# Altium project Dimmer_010.PrjPcb
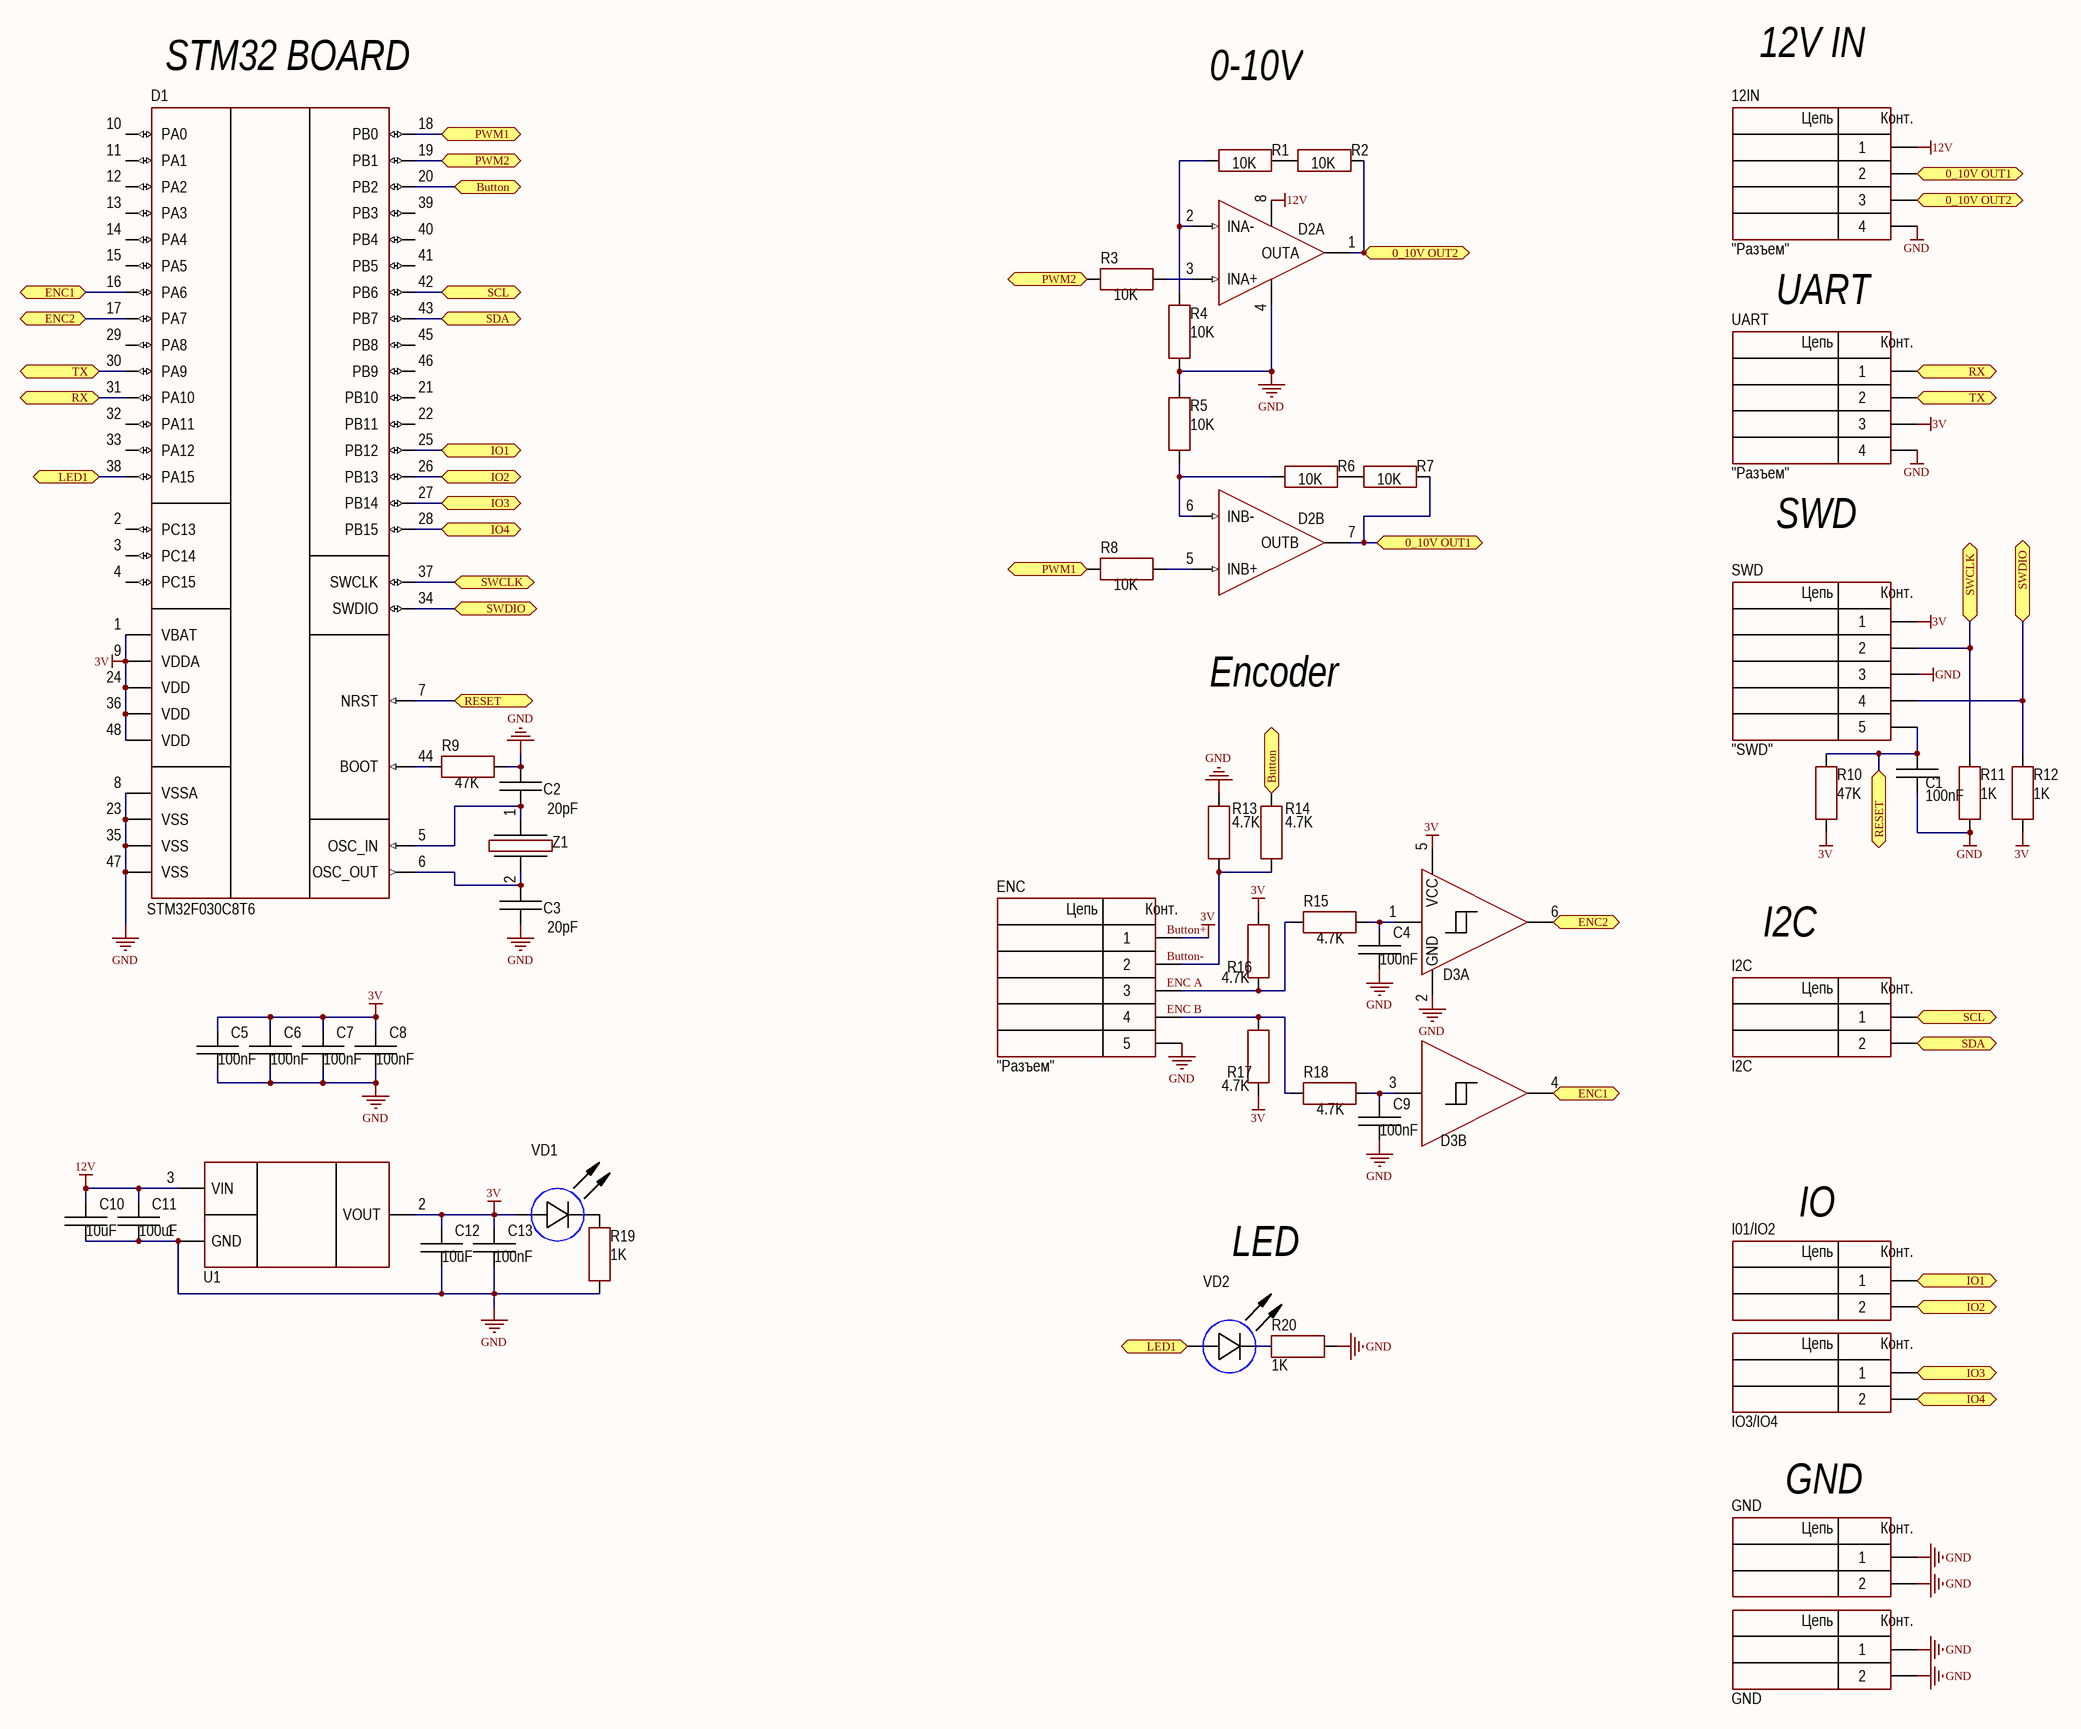
[diagram p0: 0_10V.SchDoc]
1 sheet, 49 parts. Net scope: flat (ports and power ports of the same name join across sheets).
Board file: 0_10V.PcbDoc

## Sheet 0_10V.SchDoc
size 594 x 420 mm; Address1: Address1; Address2: Address2; Address3: Address3; Address4: Address4; DocumentNumber: АБВГ.123456.001 Э3; SheetNumber: 1; Scale: 1:1; DocumentType: Схема электрическая принципиальная; FirstReferrence: АБВГ.123456.001

### Parts
(Parts that share a designator on the sheet are numbered #1, #2 ... from top to bottom, then left to right.)
12IN  CommentText: "Разъем"  [CON: PLS-4]
C1  value 100nF  [CAP: 0805]
C2  value 20pF  [CAP: 0805]
C3  value 20pF  [CAP: 0805]
C4  value 100nF  [CAP: 0805]
C5  value 100nF  [CAP: 0805]
C6  value 100nF  [CAP: 0805]
C7  value 100nF  [CAP: 0805]
C8  value 100nF  [CAP: 0805]
C9  value 100nF  [CAP: 0805]
C10  value 10uF  [CAP: 0805]
C11  value 100uF  [CAP: 0805]
C12  value 10uF  [CAP: 0805]
C13  value 100nF  [CAP: 0805]
D1  PartNumber: STM32F030C8T6  [48-LQFP]
D2  (no value)  [8-SOIC]  (parts A,B of 2)
D3  (no value)  [SOT23-6]  (parts A,B of 2)
ENC  CommentText: "Разъем"  [CON: PLS-5]
GND#1  (no value)  [CON: PLS-2]
GND#2  (no value)  [CON: PLS-2]
I01/IO2  (no value)  [CON: PLS-2]
I2C  CommentText: I2C  [CON: PLS-2]
IO3/IO4  (no value)  [CON: PLS-2]
R1  value 10K  [RES: 0805]
R2  value 10K  [RES: 0805]
R3  value 10K  [RES: 0805]
R4  value 10K  [RES: 0805]
R5  value 10K  [RES: 0805]
R6  value 10K  [RES: 0805]
R7  value 10K  [RES: 0805]
R8  value 10K  [RES: 0805]
R9  Tolerance: 47K  [RES: 0805]
R10  value 47K  [RES: 0805]
R11  value 1K  [RES: 0805]
R12  value 1K  [RES: 0805]
R13  value 4.7K  [RES: 0805]
R14  value 4.7K  [RES: 0805]
R15  value 4.7K  [RES: 0805]
R16  value 4.7K  [RES: 0805]
R17  value 4.7K  [RES: 0805]
R18  value 4.7K  [RES: 0805]
R19  Tolerance: 1K  [RES: 0805]
R20  Tolerance: 1K  [RES: 0805]
SWD  CommentText: "SWD"  [CON: PLS-5]
U1  (no value)  [SOT223]
UART  CommentText: "Разъем"  [CON: PLS-4]
VD1  (no value)  [LED: 0805R]
VD2  (no value)  [LED: 0805R]
Z1  (no value)  [OSC: 5032-2]

### Ports
0_10V OUT1, 0_10V OUT2, Button, ENC1, ENC2, IO1, IO2, IO3, IO4, LED1, PWM1, PWM2, RESET, RX, SCL, SDA, SWCLK, SWDIO, TX

### Nets
3V: C5.2 C6.2 C7.2 C8.2 C12.2 C13.2 D1.1(VBAT) D1.9(VDDA) D1.24(VDD) D1.36(VDD) D1.48(VDD) D3.5(VCC) ENC.1 R10.2 R12.2 R16.2 R17.1 SWD.1 U1.2(VOUT) UART.3 VD1.1(A)
12V: 12IN.1 C10.2 C11.2 D2.8(V+) U1.3(VIN)
GND: 12IN.4 C1.1 C2.2 C3.1 C4.1 C5.1 C6.1 C7.1 C8.1 C9.1 C10.1 C11.1 C12.1 C13.1 D1.8(VSSA) D1.23(VSS) D1.35(VSS) D1.47(VSS) D2.4(V-) D3.2(GND) ENC.5 GND#1.1 GND#1.2 GND#2.1 GND#2.2 R4.1 R5.2 R9.2 R11.2 R13.2 R19.1 R20.1 SWD.3 U1.1(GND) UART.4
Net12IN_2: 12IN.2 D2.7(OUTB) R7.1 ; port 0_10V OUT1
Net12IN_3: 12IN.3 D2.1(OUTA) R2.1 ; port 0_10V OUT2
NetC1_2: C1.2 D1.7(NRST) R10.1 SWD.5 ; port RESET
NetC2_1: C2.1 D1.5(OSC_IN) Z1.1
NetC3_2: C3.2 D1.6(OSC_OUT) Z1.2
NetC4_2: C4.2 D3.1 R15.2
NetC9_2: C9.2 D3.3 R18.2
NetD1_16: D1.16(PA6) D3.4 ; port ENC1
NetD1_17: D1.17(PA7) D3.6 ; port ENC2
NetD1_18: D1.18(PB0) R8.1 ; port PWM1
NetD1_19: D1.19(PB1) R3.1 ; port PWM2
NetD1_20: D1.20(PB2) R14.1 ; port Button
NetD1_25: D1.25(PB12) I01/IO2.1 ; port IO1
NetD1_26: D1.26(PB13) I01/IO2.2 ; port IO2
NetD1_27: D1.27(PB14) IO3/IO4.1 ; port IO3
NetD1_28: D1.28(PB15) IO3/IO4.2 ; port IO4
NetD1_30: D1.30(PA9) UART.2 ; port TX
NetD1_31: D1.31(PA10) UART.1 ; port RX
NetD1_34: D1.34(SWDIO) R12.1 SWD.4 ; port SWDIO
NetD1_37: D1.37(SWCLK) R11.1 SWD.2 ; port SWCLK
NetD1_38: D1.38(PA15) VD2.1(A) ; port LED1
NetD1_42: D1.42(PB6) I2C.1 ; port SCL
NetD1_43: D1.43(PB7) I2C.2 ; port SDA
NetD1_44: D1.44(BOOT) R9.1
NetD2_2: D2.2(INA-) R1.2 R4.2
NetD2_3: D2.3(INA+) R3.2
NetD2_5: D2.5(INB+) R8.2
NetD2_6: D2.6(INB-) R5.1 R6.2
NetENC_2: ENC.2 R13.1 R14.2
NetENC_3: ENC.3 R15.1 R16.1
NetENC_4: ENC.4 R17.2 R18.1
NetR1_1: R1.1 R2.2
NetR6_1: R6.1 R7.2
NetR19_2: R19.2 VD1.2(C)
NetR20_2: R20.2 VD2.2(C)

Not connected (* = marked no-connect by the designer): D1 2(PC13) 3(PC14) 4(PC15) 10(PA0) 11(PA1) 12(PA2) 13(PA3) 14(PA4) 15(PA5) 21(PB10) 22(PB11) 29(PA8) 32(PA11) 33(PA12) 39(PB3) 40(PB4) 41(PB5) 45(PB8) 46(PB9)

### Notes on the sheet
- (near D1) STM32 BOARD
- 12V IN
- 0-10V
- UART
- SWD
- Encoder
- I2C
- LED
- IO
- GND
- Labels drawn without touching a wire or pin: Button+, Button-, ENC A, ENC B
- Перв. примен.
- Справ. №
- Подп. и дата
- Инв. № дубл.
- Взам. инв. №
- Разраб.
- Изм.
- Лист
- № докум.
- Подп.
- Дата
- Лит.
- Масса
- Масштаб
- Пров.
- Т.контр.
- Листов
- Инв. № подл.
- Утв.
- Н.контр.
- 2.106-A2
- Копировал
- Формат А2
- (in symbol PLS-2) Цепь; Конт.
- (in symbol PLS-4) Цепь; Конт.
- (in symbol PLS-5) Цепь; Конт.

### Library data of the parts
12IN UART = PLS-4: Manufacturer: Connfly; ValueManufacturerPartNumber: Connector, 4pin, 2.54mm, 500VAC, 3A; TypeConnector: Connector; VoltageMax: 500VAC; Pitch: 2.54mm; CurrentMax: 3A; Multichannel: 4pin; HelpURL: https://www.chipdip.ru/product/pls-4; PartNumber: PLS-4
C1 = Ceramic_0805: Manufacturer: Yageo; PartNumber: C49678; TypeCapacitor: Ceramic capacitor; Tolerance: ±10%; TypeDielectric: X7R; Package: 0805; HelpURL: https://www.digikey.com/product-detail/en/yageo/CC0805KRX7R7BB104/311-1142-1-ND/303052; ValueManufacturerPartNumber: =TypeCapacitor+', '+Value+', '+TypeDielectric+', '+Tolerance+', '+Voltage+', '+Package+', '+Temperature; Temperature: -55...+125°C
C2-C13 = Ceramic_0805: Manufacturer: Yageo; PartNumber: CC0805KRX7R7BB104; TypeCapacitor: Ceramic capacitor; Tolerance: ±10%; TypeDielectric: X7R; Package: 0805; HelpURL: https://www.digikey.com/product-detail/en/yageo/CC0805KRX7R7BB104/311-1142-1-ND/303052; ValueManufacturerPartNumber: =TypeCapacitor+', '+Value+', '+TypeDielectric+', '+Tolerance+', '+Voltage+', '+Package+', '+Temperature; Temperature: -55...+125°C
D1 = STM32F103C8T6: Cortex-M3; Manufacturer: STMicroelectronics; ValueManufacturerPartNumber: IC microcontroller, 32-Bit, Cortex-M3, 72MHz, 64KB, 20KB, 2...3.6V, -40...+85°C, 48-LQFP; Supply: 2...3.6V; Speed: 72MHz; CoreSize: 32-Bit; MemoryROM: 64KB; MemoryRAM: 20KB; HelpURL: https://www.digikey.com/product-detail/en/stmicroelectronics/STM32F103C8T6TR/497-17666-1-ND/7804402; Package: 48-LQFP; ComponentType: IC microcontroller; Temperature: -40...+85°C; CoreProcessor: Cortex-M3; LCSC: C23922
D2 = LM358_: OP amplifier; Manufacturer: Texas Instruments; ValueManufacturerPartNumber: IC op amplifier, Rail-to-Rail, 3 MHz, 2.7...5.5V, -40...+125°C, SOT23-5; PartNumber: OPA2337EA/3K; Supply: 2.7...5.5V; OutputType: Rail-to-Rail; GainBandwidth: 3 MHz; HelpURL: https://www.digikey.com/product-detail/en/texas-instruments/OPA2337EA-3K/296-26252-1-ND/2254915; Package: SOT23-5; ComponentType: IC op amplifier; Temperature: -40...+125°C
D3 = SN74LVC2G17DBVR: BUFFERS, DRIVERS, RECEIVERS,; Manufacturer: Texas Instruments; ValueManufacturerPartNumber: IC op amplifier, Rail-to-Rail, 3 MHz, 2.7...5.5V, -40...+125°C, SOT23-6; Supply: 2.7...5.5V; OutputType: Rail-to-Rail; GainBandwidth: 3 MHz; HelpURL: https://www.digikey.com/product-detail/en/texas-instruments/OPA2337EA-3K/296-26252-1-ND/2254915; Package: SOT23-6; ComponentType: IC op amplifier; Temperature: -40...+125°C; PartNumber: SN74LVC2G17DBVR; LCSC: C10429
ENC SWD = PLS-5: Manufacturer: Connfly; ValueManufacturerPartNumber: Connector, 5pin, 2.54mm, 500VAC, 3A; TypeConnector: Connector; VoltageMax: 500VAC; Pitch: 2.54mm; CurrentMax: 3A; Multichannel: 5pin; HelpURL: https://www.chipdip.ru/product/pls-5; PartNumber: PLS-5
GND#1 GND#2 I01/IO2 I2C IO3/IO4 = PLS-2: Manufacturer: Connfly; ValueManufacturerPartNumber: Connector, 2pin, 2.54mm, 500VAC, 3A; TypeConnector: Connector; VoltageMax: 500VAC; Pitch: 2.54mm; CurrentMax: 3A; Multichannel: 2pin; HelpURL: https://www.chipdip.ru/product/pls-2; PartNumber: PLS-2
R1-R9 R13-R20 = Resistor_0805: Manufacturer: Yageo; PartNumber: RC0805JR-07100RL; TypeResistor: Resistor film; Power: 0.125W; Package: 0805; HelpURL: https://www.digikey.com/product-detail/en/yageo/RC0805JR-07100RL/311-100ARCT-ND/731185; ValueManufacturerPartNumber: =TypeResistor+', '+Value+', '+Tolerance+', '+Package+', '+Power+', '+Temperature; Temperature: -55...+125°C
  R3: lcsc: C17414
R10 = Resistor_0805: Manufacturer: Yageo; PartNumber: C17713; TypeResistor: Resistor film; Power: 0.125W; Package: 0805; HelpURL: https://www.digikey.com/product-detail/en/yageo/RC0805JR-07100RL/311-100ARCT-ND/731185; ValueManufacturerPartNumber: =TypeResistor+', '+Value+', '+Tolerance+', '+Package+', '+Power+', '+Temperature; Temperature: -55...+125°C
R11 R12 = Resistor_0805: Manufacturer: Yageo; PartNumber: C17513; TypeResistor: Resistor film; Power: 0.125W; Package: 0805; HelpURL: https://www.digikey.com/product-detail/en/yageo/RC0805JR-07100RL/311-100ARCT-ND/731185; ValueManufacturerPartNumber: =TypeResistor+', '+Value+', '+Tolerance+', '+Package+', '+Power+', '+Temperature; Temperature: -55...+125°C
U1 = AMS1117-3.3: Linear voltage regulator; Manufacturer: Texas Instruments; ValueManufacturerPartNumber: Linear voltage regulator, input17V, 0.25V, output 3.3V, 700mA, -40...+85°C, SOT-23-5; VoltageInput: input17V; MaxDropout: 0.25V; CurrentOutput: 700mA; VoltageOutput: output 3.3V; HelpURL: *; Package: SOT-23-5; ComponentType: Linear voltage regulator; Temperature: -40...+85°C; LCSC: C6186
VD1 VD2 = LED_single: ValueManufacturerPartNumber: LED, Green, *, *, *, -55...+150°C; TypeDiode: LED; ColorParameter: Green; Manufacturer: *; Package: *; HelpURL: *; Temperature: -55...+150°C; Current: *; VoltageDrop: *; PartNumber: *
Z1 = Crystal_3215: Manufacturer: Epson; PartNumber: FC-135 32.7680KA-A5; LoadCapacitance: 12.5pF; Tolerance: ±20ppm; Package: case 3215; HelpURL: https://www.digikey.com/product-detail/en/epson/FC-135-32.7680KA-A5/SER4103CT-ND/6188447; ValueManufacturerPartNumber: =TypeOscilator+', '+Frequency+', '+LoadCapacitance+', '+Tolerance+', '+Package+', '+Temperature; Temperature: -40...+85°C; TypeOscilator: Crystal